# EAGLE schematic interface_board_circuit (EAGLE 6.3)
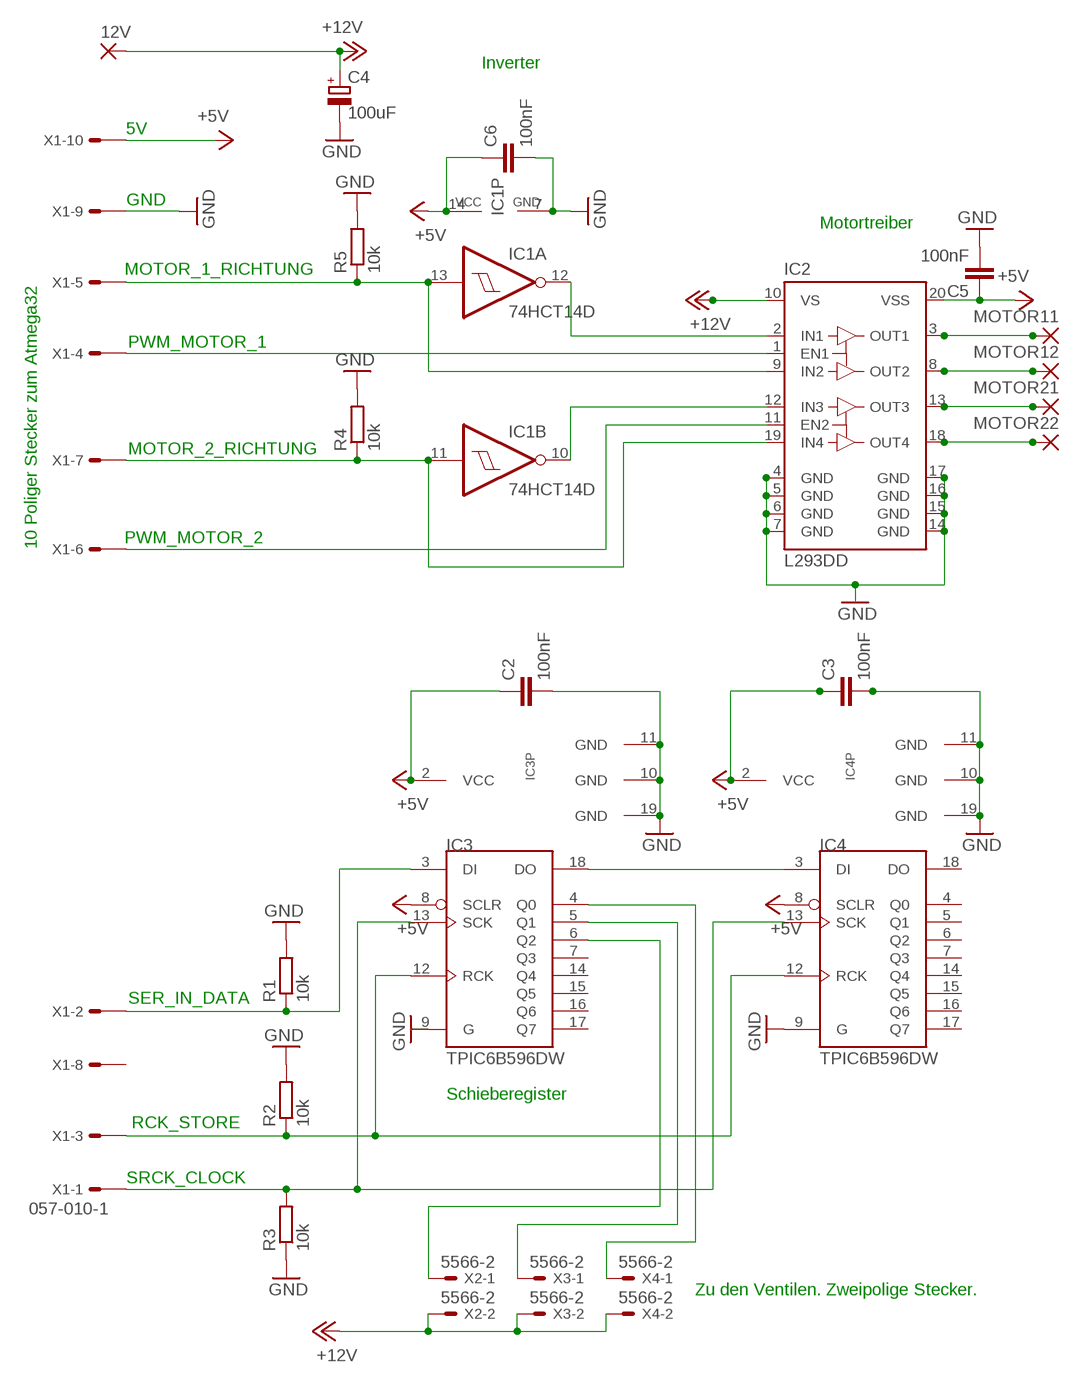
[diagram p0: schematic, sheet 1]

## Parts
12V  1,6/0,9  [1,6/0,9]
C2  100nF  C-EUC0603  [C0603]
C3  100nF  C-EUC0603  [C0603]
C4  100uF  CPOL-EUD  [PANASONIC_D]
C5  100nF  C-EUC0603  [C0603]
C6  100nF  C-EUC0603  [C0603]
IC1  74HCT14D  [SO14]
IC2  L293DD  [SO20]
IC3  TPIC6B596DW  [SO20W]
IC4  TPIC6B596DW  [SO20W]
MOTOR11  2,54/1,1  [2,54/1,1]
MOTOR12  2,54/1,1  [2,54/1,1]
MOTOR21  2,54/1,1  [2,54/1,1]
MOTOR22  2,54/1,1  [2,54/1,1]
R1  10k  R-EU_M0805  [M0805]
R2  10k  R-EU_M0805  [M0805]
R3  10k  R-EU_M0805  [M0805]
R4  10k  R-EU_M0805  [M0805]
R5  10k  R-EU_M0805  [M0805]
X1  057-010-1  [057-010-1]
X2  5566-2  [5566-2]
X3  5566-2  [5566-2]
X4  5566-2  [5566-2]

## Nets
+5V: C2.1 C3.1 C5.1 C6.1 IC1.14(P:VCC) IC2.20(VSS) IC3.2(VCC) IC3.8(SCLR) IC4.2(VCC) IC4.8(SCLR) X1.10
+12V: 12V.1(P) C4.+ IC2.10(VS) X2.2 X3.2 X4.2
GND: C2.2 C3.2 C4.- C5.2 C6.2 IC1.7(P:GND) IC2.4(GND) IC2.5(GND) IC2.6(GND) IC2.7(GND) IC2.14(GND) IC2.15(GND) IC2.16(GND) IC2.17(GND) IC3.9(G) IC3.10(GND) IC3.11(GND) IC3.19(GND) IC4.9(G) IC4.10(GND) IC4.11(GND) IC4.19(GND) R1.2 R2.2 R3.1 R4.2 R5.2 X1.9
N$1: IC1.13(A:I) IC2.9(IN2) R5.1 X1.5
N$2: IC3.4(Q0) X4.1
N$3: IC2.18(OUT4) MOTOR22.1(P)
N$5: IC2.1(EN1) X1.4
N$6: IC2.11(EN2) X1.6
N$7: IC2.13(OUT3) MOTOR21.1(P)
N$8: IC1.12(A:O) IC2.2(IN1)
N$9: IC1.10(B:O) IC2.12(IN3)
N$10: IC2.8(OUT2) MOTOR12.1(P)
N$11: IC3.5(Q1) X3.1
N$12: IC2.3(OUT1) MOTOR11.1(P)
N$13: IC3.6(Q2) X2.1
N$14: IC1.11(B:I) IC2.19(IN4) R4.1 X1.7
N$15: IC3.18(DO) IC4.3(DI)
N$16: IC3.3(DI) R1.1 X1.2
N$18: IC3.12(RCK) IC4.12(RCK) R2.1 X1.3
N$19: IC3.13(SCK) IC4.13(SCK) R3.2 X1.1
Unconnected: IC1.1(D:I) IC1.2(D:O) IC1.3(E:I) IC1.4(E:O) IC1.5(F:I) IC1.6(F:O) IC1.8(C:O) IC1.9(C:I) IC3.7(Q3) IC3.14(Q4) IC3.15(Q5) IC3.16(Q6) IC3.17(Q7) IC4.4(Q0) IC4.5(Q1) IC4.6(Q2) IC4.7(Q3) IC4.14(Q4) IC4.15(Q5) IC4.16(Q6) IC4.17(Q7) IC4.18(DO) X1.8

## Notes on the sheet
- Inverter
- 5V
- GND
- Motortreiber
- MOTOR_1_RICHTUNG
- PWM_MOTOR_1
- MOTOR_2_RICHTUNG
- PWM_MOTOR_2
- 10 Poliger Stecker zum Atmega32
- SER_IN_DATA
- Schieberegister
- RCK_STORE
- SRCK_CLOCK
- Zu den Ventilen. Zweipolige Stecker.

## Library data of the parts
12V = wirepad:1,6/0,9: THROUGH-HOLE PAD
C2 C3 C5 C6 = rcl:C-EU: CAPACITOR, European symbol
C4 = rcl:CPOL-EU: POLARIZED CAPACITOR, European symbol
IC1 = 74xx-eu:74*14: Hex schmitt trigger INVERTER
IC2 = st-microelectronics:L293DD: PUSH-PULL FOUR CHANNEL DRIVER WITH DIODES Source: http://www.st.com/stonline/books/pdf/docs/1330.pdf; OC_FARNELL: unknown
IC3 IC4 = tpic:TPIC6B596
MOTOR11 MOTOR12 MOTOR21 MOTOR22 = wirepad:2,54/1,1: THROUGH-HOLE PAD
R1-R5 = resistor:R-EU_: RESISTOR, European symbol
X1 = con-panduit:057-010-: CONNECTOR 10-pin series 057 contact pc board low profile headers; OC_FARNELL: unknown; OC_NEWARK: unknown
X2-X4 = con-molex:5566-2: Mini FIT connector 2 pol Source: http://www.molex.com; OC_FARNELL: 1822072; OC_NEWARK: unknown